# Altium schematic sheet 15.SchDoc
size 513 x 386 mm
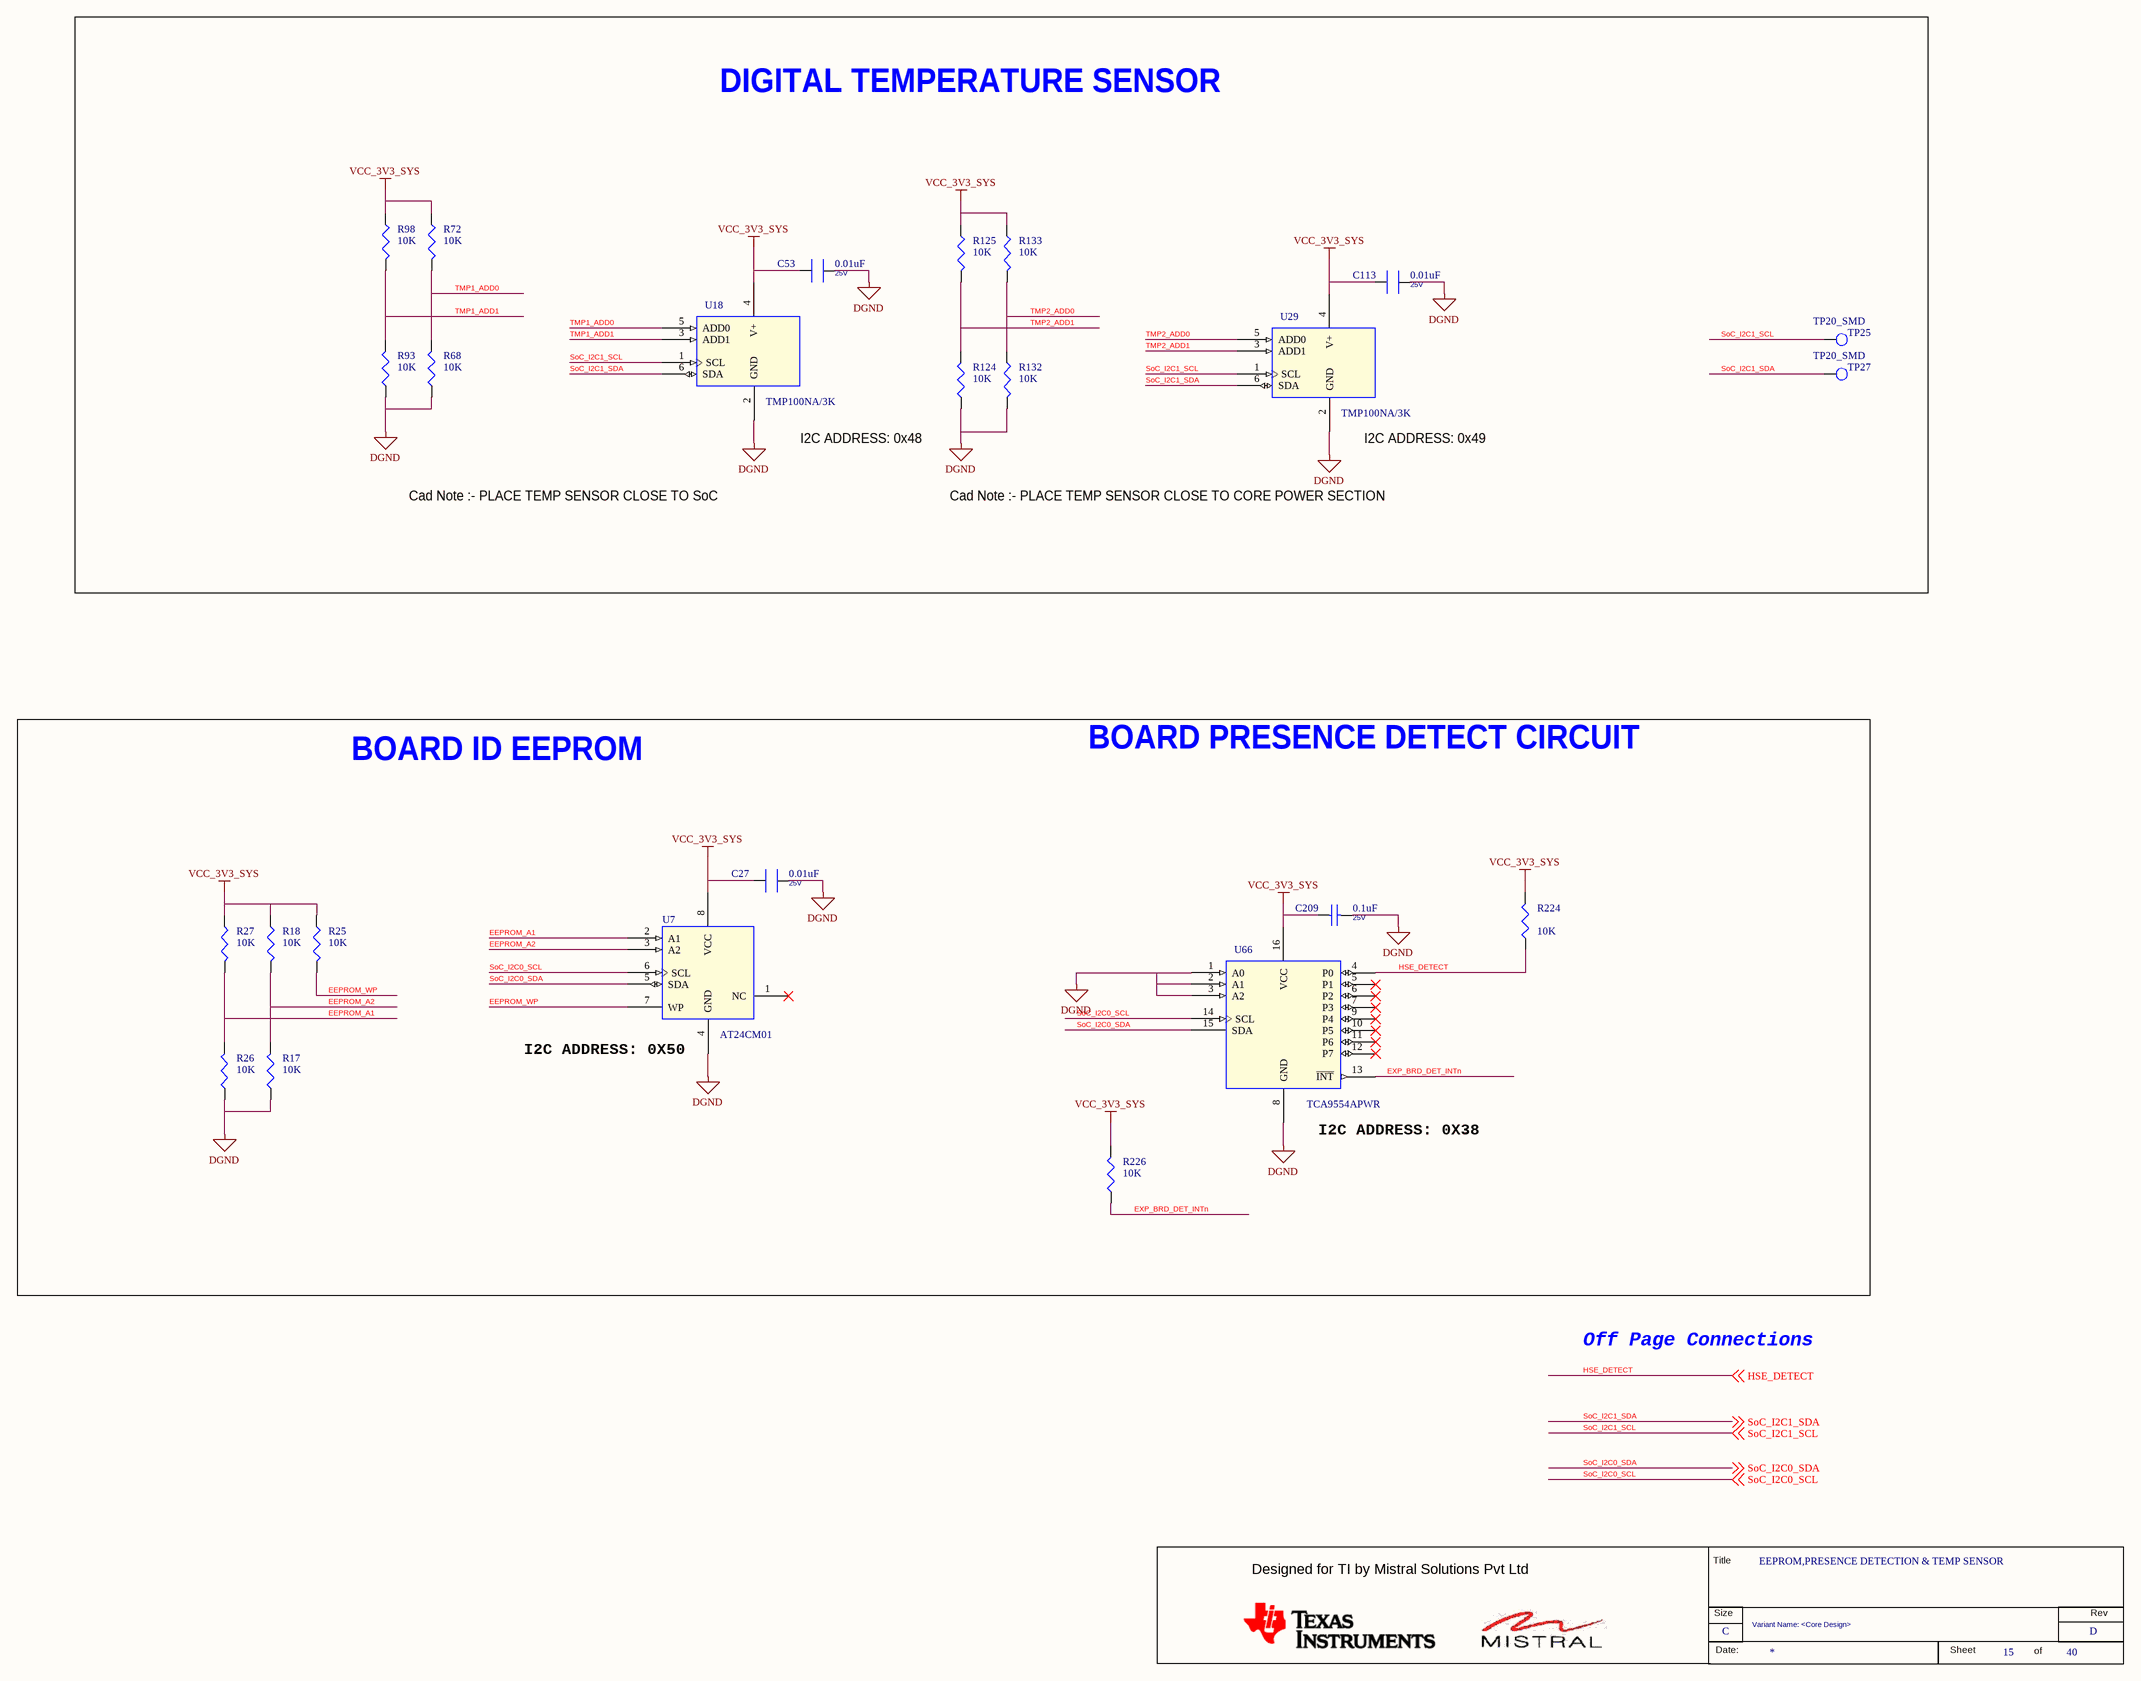
[diagram p0: 15.SchDoc]

## Parts
*  RevCode: D  Title: EEPROM,PRESENCE DETECTION & TEMP SENSOR  Page Size: C  Page Number: 15  Page Count: 40  Variant Name: <Core Design>  (hidden comment: MISTRAL_TITLEBLK_CSIZE)  (graphical)
C27  0.01uF  Voltage: 25V  [CAP0402N]
C53  0.01uF  Voltage: 25V  [CAP0402N]
C113  0.01uF  Voltage: 25V  [CAP0402N]
C209  0.1uF  Voltage: 25V  [CAP0402_0-75]
R17  10K  [RES0402_0-5]
R18  10K  [RES0402_0-5]
R25  10K  [RES0402_0-5]
R26  10K  [RES0402_0-5]
R27  10K  [RES0402_0-5]
R68  10K  [RES0402_0-5]
R72  10K  [RES0402_0-5]
R93  10K  [RES0402_0-5]
R98  10K  [RES0402_0-5]
R124  10K  [RES0402_0-5]
R125  10K  [RES0402_0-5]
R132  10K  [RES0402_0-5]
R133  10K  [RES0402_0-5]
R224  10K  [RES0402_0-5]
R226  10K  [RES0402_0-5]
TP25  TP20_SMD  [TP20_SMD]
TP27  TP20_SMD  [TP20_SMD]
U7  AT24CM01  [TSSOP8_25-59_125X180_1-2]
U18  TMP100NA/3K  [SOT23-6_1-5]
U29  TMP100NA/3K  [SOT23-6_1-5]
U66  TCA9554APWR  [TSSOP16_25-59_205X180_1-2]

## Blocks framed on the sheet
DIGITAL TEMPERATURE SENSOR: C53 C113 R68 R72 R93 R98 R124 R125 R132 R133 TP25 TP27 U18 U29

## Nets
DGND: C27.1 C53.1 C113.1 C209.2 R17.1 R26.1 R68.1 R93.1 R124.1 R132.2 U7.4(GND) U18.2(GND) U29.2(GND) U66.1(A0) U66.2(A1) U66.3(A2) U66.8(GND)
VCC_3V3_SYS: C27.2 C53.2 C113.2 C209.1 R18.1 R25.1 R27.1 R72.1 R98.1 R125.1 R133.1 R224.2 R226.2 U7.8(VCC) U18.4(V+) U29.4(V+) U66.16(VCC)
EEPROM_A1: R26.2 R27.2 U7.2(A1)
EEPROM_A2: R17.2 R18.2 U7.3(A2)
EEPROM_WP: R25.2 U7.7(WP)
EXP_BRD_DET_INTn: R226.1 U66.13(~{INT})
HSE_DETECT: R224.1 U66.4(P0) ; off-sheet HSE_DETECT
SoC_I2C0_SCL: U7.6(SCL) U66.14(SCL) ; off-sheet SoC_I2C0_SCL
SoC_I2C0_SDA: U7.5(SDA) U66.15(SDA) ; off-sheet SoC_I2C0_SDA
SoC_I2C1_SCL: TP25.1(TP) U18.1(SCL) U29.1(SCL) ; off-sheet SoC_I2C1_SCL
SoC_I2C1_SDA: TP27.1(TP) U18.6(SDA) U29.6(SDA) ; off-sheet SoC_I2C1_SDA
TMP1_ADD0: R68.2 R72.2 U18.5(ADD0)
TMP1_ADD1: R93.2 R98.2 U18.3(ADD1)
TMP2_ADD0: R132.1 R133.2 U29.5(ADD0)
TMP2_ADD1: R124.2 R125.2 U29.3(ADD1)

Not connected (* = marked no-connect by the designer): U7 1(NC)*; U66 5(P1)* 6(P2)* 7(P3)* 9(P4)* 10(P5)* 11(P6)* 12(P7)*

## Notes on the sheet
- I2C ADDRESS: 0x48
- I2C ADDRESS: 0x49
- Cad Note :- PLACE TEMP SENSOR CLOSE TO SoC
- Cad Note :- PLACE TEMP SENSOR CLOSE TO CORE POWER SECTION
- BOARD ID EEPROM
- BOARD PRESENCE DETECT CIRCUIT
- (near U7) I2C ADDRESS: 0X50
- (near U66) I2C ADDRESS: 0X38
- Off Page Connections
- (in symbol MISTRAL_TITLEBLK_CSIZE) Title; Designed for TI by Mistral Solutions Pvt Ltd; Size; Rev; Date:; Sheet; of

## Library data of the parts
* = MISTRAL_TITLEBLK_CSIZE: Issue: 1.0; Page Create Date: March  8, 1995; Page Modify Date: *
C27 = CAP_Dup2: CAP CERAMIC 0.01uF 25V 10% X7R 0402; Part_type: CAPACITORS\CERAMIC; Mfr_part_number: 885012205050; Mfr_name: WURTH ELECTRONICS; Mistral Part No: 120011090040-R; MECHANICAL 3D STEP FILE: CAP0402_0-75; Wattage: NA; Custom_Duty: 15%; Customs_HS_Code: 85322990; Project: AM64x_EVM_BRD; Footprint Path: Y:\MIS_DATABASE\Library\ALTIUM_TOOL\PCB_FOOTPRINTS\Altium_Footprint_Lib.PcbLib; Library Path: Y:\MIS_DATABASE\Library\ALTIUM_TOOL\SCHEMATICS_PARTS\MS_DISCRETE_Library.schlib; Footprint Ref: CAP0402_0-75; Temperature: -55癈+125癈; Weight: 0.65mg; Chkd/date: MANIRAJA/170820; Crtd /date: ALVY/170820; Datasheet: Y:\MIS_DATABASE\DATASHEETS\CAPACITORS\885012205050.PDF; Height: 0.55MM; Distributor_part_number: 732-7545-1-ND; Distributor_name: DIGIKEY; Package: 0402; Tolerance: 10%; Library Ref: CAP; PCB Footprint: CAP0402_0-75
C53 C113 = CAP_Dup2: CAP CERAMIC 0.01uF 25V 10% X7R 0402; Mistral Part No: 120011090040-R; Mfr_name: WURTH ELECTRONICS; Mfr_part_number: 885012205050; Part_type: CAPACITORS\CERAMIC; Project: AM64x_EVM_BRD; Customs_HS_Code: 85322990; Custom_Duty: 15%; Wattage: NA; MECHANICAL 3D STEP FILE: CAP0402_0-75; Library Ref: CAP; Tolerance: 10%; Package: 0402; Distributor_name: DIGIKEY; Distributor_part_number: 732-7545-1-ND; Height: 0.55MM; Datasheet: Y:\MIS_DATABASE\DATASHEETS\CAPACITORS\885012205050.PDF; Crtd /date: ALVY/170820; Chkd/date: MANIRAJA/170820; Weight: 0.65mg; Temperature: -55癈+125癈; Footprint Ref: CAP0402_0-75; Library Path: Y:\MIS_DATABASE\Library\ALTIUM_TOOL\SCHEMATICS_PARTS\MS_DISCRETE_Library.schlib; Footprint Path: Y:\MIS_DATABASE\Library\ALTIUM_TOOL\PCB_FOOTPRINTS\Altium_Footprint_Lib.PcbLib; PCB Footprint: CAP0402_0-75
C209 = CAP_Dup3: CAP CERAMIC 0.1uF 25V 20% X5R 0402; Alt_Mfr_name: YAGEO AMERICA; Part_type: CAPACITORS\CERAMIC; Mfr_part_number: 885012105018; Mfr_name: WURTH ELECTRONICS; Mistral Part No: 120020080003-R; Alt_Mfr_part_number: CC0402KRX5R8BB104; Custom_Duty: 15%; Customs_HS_Code: 85322990; Wattage: NA; Project: AM64x_EVM_BRD; Footprint Path: Y:\MIS_DATABASE\Library\ALTIUM_TOOL\PCB_FOOTPRINTS\Altium_Footprint_Lib.PcbLib; Library Path: Y:\MIS_DATABASE\Library\ALTIUM_TOOL\SCHEMATICS_PARTS\MS_DISCRETE_Library.schlib; Footprint Ref: CAP0402_0-75; Library Ref: CAP; MECHANICAL 3D STEP FILE: CAP0402_0-75; Chkd/date: MANIRAJA/170820; Crtd /date: ALVY/170820; Datasheet: Y:\MIS_DATABASE\DATASHEETS\CAPACITORS\885012105018.PDF; Temperature: -55癈+85癈; Weight: 0.65mg; Height: 0.55MM; Distributor_part_number: 732-7495-1-ND; Distributor_name: DIGIKEY; Package: 0402; Tolerance: 20%; PCB Footprint: CAP0402_0-75
R17 R68 R72 R98 R124 R224 = RESISTOR_Dup6: RES 10K 1/16W 5% 0402; Part_type: RESISTORS\FIXED; Mfr_part_number: RC0402JR-0710KL; Mfr_name: YAGEO AMERICA; Mistral Part No: 110011060021-R; Custom_Duty: 15%; Customs_HS_Code: 85332119; Voltage: NA; Project: HSE; PCB Footprint: RES0402_0-5; Footprint Path: Y:\MIS_DATABASE\Library\ALTIUM_TOOL\PCB_FOOTPRINTS\Altium_Footprint_Lib.PcbLib; Library Path: Y:\MIS_DATABASE\Library\ALTIUM_TOOL\SCHEMATICS_PARTS\MS_DISCRETE_Library.schlib; Footprint Ref: RES0402_0-5; Library Ref: RESISTOR; MECHANICAL 3D STEP FILE: RES0402_0-5; Chkd/date: VASANTHA/061216; Crtd /date: MAZHAR/230805; Datasheet: Y:\MIS_DATABASE\DATASHEETS\RESISTORS\RCXXXXL-SER_MAR18.PDF; Temperature: -55癈+155癈; Weight: 0.65mg; Height: 0.40MM; Distributor_part_number: 311-10KJRCT-ND; Distributor_name: DIGIKEY; Package: 0402; Wattage: 1/16W; Tolerance: 5%
R18 R25-R27 R93 R125 R132 R133 R226 = RESISTOR_Dup6: RES 10K 1/16W 5% 0402; Mistral Part No: 110011060021-R; Mfr_name: YAGEO AMERICA; Mfr_part_number: RC0402JR-0710KL; Part_type: RESISTORS\FIXED; Project: HSE; Voltage: NA; Customs_HS_Code: 85332119; Custom_Duty: 15%; PCB Footprint: RES0402_0-5; Footprint Path: Y:\MIS_DATABASE\Library\ALTIUM_TOOL\PCB_FOOTPRINTS\Altium_Footprint_Lib.PcbLib; Library Path: Y:\MIS_DATABASE\Library\ALTIUM_TOOL\SCHEMATICS_PARTS\MS_DISCRETE_Library.schlib; Footprint Ref: RES0402_0-5; Library Ref: RESISTOR; Tolerance: 5%; Wattage: 1/16W; Package: 0402; Distributor_name: DIGIKEY; Distributor_part_number: 311-10KJRCT-ND; Height: 0.40MM; Weight: 0.65mg; Temperature: -55癈+155癈; Datasheet: Y:\MIS_DATABASE\DATASHEETS\RESISTORS\RCXXXXL-SER_MAR18.PDF; Crtd /date: MAZHAR/230805; Chkd/date: VASANTHA/061216; MECHANICAL 3D STEP FILE: RES0402_0-5
TP25 TP27 = TESTPOINT: TESTPOINT CIR 20 SMD; Mfr_name: LOCAL; Custom_Duty: NA; Project: BT MODULE_CSRBC04; Customs_HS_Code: NA; Mistral Part No: NA; Mfr_part_number: TP20_SMD; Part_type: TESTPOINT; Package: SMD; Distributor_name: NA; Distributor_part_number: NA; Height: NA; Crtd /date: MAZHAR/171006; Chkd/date: SHREESHAIL/171006; Tolerance: NA; Voltage: NA; Wattage: NA; Weight: NA; Temperature: NA; Datasheet: NA; MECHANICAL 3D STEP FILE: NA; Library Path: Y:\MIS_DATABASE\Library\ALTIUM_TOOL\SCHEMATICS_PARTS\MS_DISCRETE_Library.schlib; Footprint Path: Y:\MIS_DATABASE\Library\ALTIUM_TOOL\PCB_FOOTPRINTS\Altium_Footprint_Lib.PcbLib; Library Ref: TESTPOINT; Footprint Ref: TP20_SMD; RoHS: NA; PCB Footprint: TP20_SMD
U7 = AT24HC04B-TH-B_TSSOP8: IC 1MBIT I2C SERIAL EEPROM TSSOP8; Mistral Part No: 141114090006-R; Mfr_name: ATMEL; Mfr_part_number: AT24CM01-XHD-T; Part_type: ICS\DIGITAL\MEMORY; Project: GALILEO_EVM; Tolerance: NA; Customs_HS_Code: 85423100; Custom_Duty: 15%; Library Ref: AT24HC04B-TH-B_TSSOP8; Voltage: NA; Wattage: NA; Package: TSSOP8; Distributor_name: DIGIKEY; Distributor_part_number: AT24CM01-XHD-TCT-ND; Height: 1.20MM; Weight: 158mg; Temperature: -40癈+85癈; Datasheet: Y:\MIS_DATABASE\DATASHEETS\ICS\MEMORY\AT24CM01.PDF; Crtd /date: VASANTHA/230914; Chkd/date: NAVEED/241114; MECHANICAL 3D STEP FILE: TSSOP8_25-59_125X180_1-2; PCB Footprint: TSSOP8_25-59_125X180_1-2
U18 = TMP100NA/3K_SOT23-6: IC TEMPERATURE SENSOR WITH I2C AND SMBUS INTERFACE SOT23-6; Part_type: ICS\DIGITAL\PERIPHERAL; Mfr_name: TEXAS INSTRUMENTS; Mistral Part No: 141017080030-R; Custom_Duty: 15%; Customs_HS_Code: 85423100; Wattage: NA; Project: TI_MAXIE_CPB; MECHANICAL 3D STEP FILE: SOT23-6_1-5; Chkd/date: MANIRAJA/290817; Crtd /date: MANIRAJA/290817; Datasheet: Y:\MIS_DATABASE\DATASHEETS\ICS\DIGITAL\PERIPHERAL\TMP10XX.PDF; Temperature: -55癈+125癈; Weight: 120mg; Height: 1.45MM; Distributor_part_number: 296-26833-1-ND; Distributor_name: DIGIKEY; Package: SOT23-6; Voltage: NA; Tolerance: NA; Mfr_part_number: TMP100NA/3K; Library Ref: TMP100NA/3K_SOT23-6; PCB Footprint: SOT23-6_1-5
U29 = TMP100NA/3K_SOT23-6: IC TEMPERATURE SENSOR WITH I2C AND SMBUS INTERFACE SOT23-6; Mistral Part No: 141017080030-R; Mfr_name: TEXAS INSTRUMENTS; Part_type: ICS\DIGITAL\PERIPHERAL; Project: TI_MAXIE_CPB; Tolerance: NA; Customs_HS_Code: 85423100; Custom_Duty: 15%; Mfr_part_number: TMP100NA/3K; Voltage: NA; Wattage: NA; Package: SOT23-6; Distributor_name: DIGIKEY; Distributor_part_number: 296-26833-1-ND; Height: 1.45MM; Weight: 120mg; Temperature: -55癈+125癈; Datasheet: Y:\MIS_DATABASE\DATASHEETS\ICS\DIGITAL\PERIPHERAL\TMP10XX.PDF; Crtd /date: MANIRAJA/290817; Chkd/date: MANIRAJA/290817; MECHANICAL 3D STEP FILE: SOT23-6_1-5; Library Ref: TMP100NA/3K_SOT23-6; PCB Footprint: SOT23-6_1-5
U66 = TCA9554APWR_TSSOP16: IC 8-BIT I2C AND SMBUS I/O EXPANDER WITH INTERRUPT O/P TSSOP16; Mistral Part No: 141017090007-R; Mfr_name: TEXAS INSTRUMENTS; Part_type: ICS\DIGITAL\BUSTRANSCEIVER; Project: TI_MAXIE_CPB; Tolerance: NA; Customs_HS_Code: 85423100; Custom_Duty: 15%; Library Ref: TCA9554APWR_TSSOP16; Mfr_part_number: TCA9554APWR; Voltage: NA; Wattage: NA; Package: TSSOP16; Distributor_name: DIGIKEY; Distributor_part_number: 296-28120-1-ND; Height: 1.20MM; Weight: 173mg; Temperature: -40癈+85癈; Datasheet: Y:\MIS_DATABASE\DATASHEETS\ICS\DIGITAL\BUSTRANSCEIVER\TCA9554.PDF; Crtd /date: MANIRAJA/110917; Chkd/date: MANIRAJA/110917; MECHANICAL 3D STEP FILE: TSSOP16_25-59_205X180_1-2; PCB Footprint: TSSOP16_25-59_205X180_1-2